# EAGLE design multiplex2 (EAGLE 8.7.1)
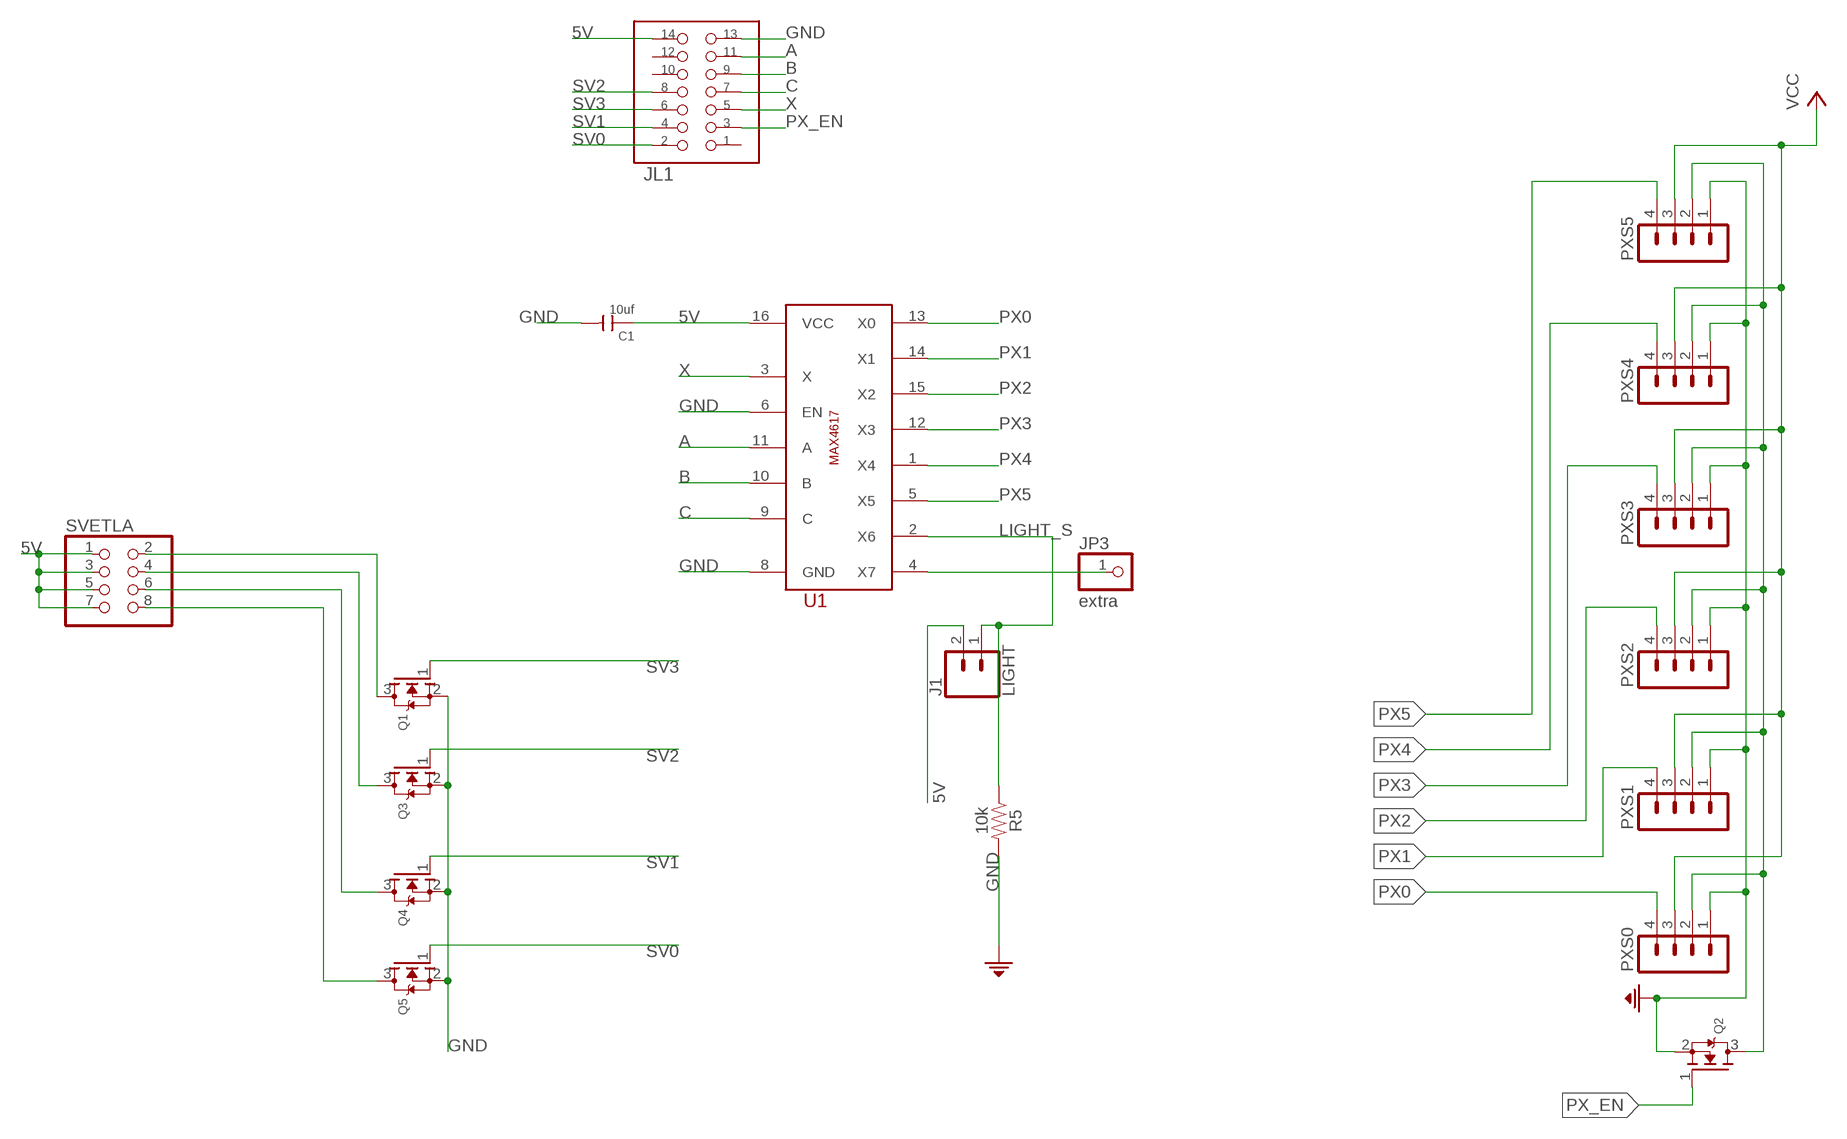
[diagram p0: schematic, sheet 1]

## Parts
C1  10uf  CERAMIC-10UF-25V-10%-X5R(1206)  [C1206]
J1  LIGHT  CONN_02  [1X02]
JL1  DS1014-14S  [DS1014-14S]
JP3  extra  PINHD-1X1  [1X01]
PXS0  MA04-1  [MA04-1]
PXS1  MA04-1  [MA04-1]
PXS2  MA04-1  [MA04-1]
PXS3  MA04-1  [MA04-1]
PXS4  MA04-1  [MA04-1]
PXS5  MA04-1  [MA04-1]
Q1  MOSFET-NREFLOW  [SOT23]
Q2  MOSFET-NREFLOW  [SOT23]
Q3  MOSFET-NREFLOW  [SOT23]
Q4  MOSFET-NREFLOW  [SOT23]
Q5  MOSFET-NREFLOW  [SOT23]
R5  10k  100KOHM-0603-1/10W-1%  [0603]
SVETLA  PINHD-2X4  [2X04]
U1  MAX4617CUE+T  [TSSOP16]

## Nets
5V: C1.1 J1.2 JL1.P$14 PXS0.3 PXS1.3 PXS2.3 PXS3.3 PXS4.3 PXS5.3 SVETLA.1 SVETLA.3 SVETLA.5 SVETLA.7 U1.16(VCC) ; supply symbol labelled VCC
A: JL1.P$11 U1.11(A)
B: JL1.P$9 U1.10(B)
C: JL1.P$7 U1.9(C)
GND: C1.2 JL1.P$13 PXS0.1 PXS1.1 PXS2.1 PXS3.1 PXS4.1 PXS5.1 Q1.2(S) Q2.2(S) Q3.2(S) Q4.2(S) Q5.2(S) R5.2 U1.6(EN) U1.8(GND)
LIGHT_S: J1.1 R5.1 U1.2(X6)
N$1: Q1.3(D) SVETLA.2
N$2: Q3.3(D) SVETLA.4
N$3: Q4.3(D) SVETLA.6
N$4: Q5.3(D) SVETLA.8
N$8: JP3.1 U1.4(X7)
PX0: PXS0.4 U1.13(X0)
PX1: PXS1.4 U1.14(X1)
PX2: PXS2.4 U1.15(X2)
PX3: PXS3.4 U1.12(X3)
PX4: PXS4.4 U1.1(X4)
PX5: PXS5.4 U1.5(X5)
PX_EN: JL1.P$3 Q2.1(G)
PXSO: PXS0.2 PXS1.2 PXS2.2 PXS3.2 PXS4.2 PXS5.2 Q2.3(D)
SV0: JL1.P$2 Q5.1(G)
SV1: JL1.P$4 Q4.1(G)
SV2: JL1.P$8 Q3.1(G)
SV3: JL1.P$6 Q1.1(G)
X: JL1.P$5 U1.3(X)
Unconnected: JL1.P$1 JL1.P$10 JL1.P$12

## Library data of the parts
C1 = OPL_Capacitor:CERAMIC-10UF-25V-10%-X5R(1206): 302010181; MPN: CC1206KKX5R8BB106
J1 = SparkFun-Connectors:CONN_02: Multi connection point. Often used as Generic Header-pin footprint for 0.1 inch spaced/style header connections On any of the 0.1 inch spaced packages, you can populate with these: Break Away Headers - Straight <https://www.sparkfun.com/products/116> (PRT-00116) Break Away Male Headers - Right Angle <https://www.sparkfun.com/products/553> (PRT-00553) Female Headers <https://www.sparkfun.com/products/115> (PRT-00115) Break Away Headers - Machine Pin <https://www.sparkfun.com/products/117> (PRT-00117) Break Away Female Headers - Swiss Machine Pin <https://www.sparkfun.com/products/743> (PRT-00743) For SCREWTERMINALS and SPRING TERMINALS visit here: Screw Terimnals on SparkFun.com <https://www.sparkfun.com/search/results?term=Screw+Terminals> (5mm/3.5mm/2.54mm spacing) This device is also useful as a general connection point to wire up your design to another part of your project. Our various solder wires solder well into these plated through hole pads. Hook-Up Wire - Assortment (Stranded, 22 AWG) <https://www.sparkfun.com/products/11375> (PRT-11375) Hook-Up Wire - Assortment (Solid Core, 22 AWG) <https://www.sparkfun.com/products/11367> (PRT-11367) View the entire wire category on our website here <https://www.sparkfun.com/categories/141> Special notes: Molex polarized connector foot print use with: PRT-08233 with associated crimp pins and housings. 2.54_SCREWTERM for use with PRT-10571. 3.5mm Screw Terminal footprints for PRT-08084 5mm Screw Terminal footprints for use with PRT-08432
JL1 = columba:DS1014-14S
JP3 = adafruit:PINHD-1X1: Pin header 1x1 for 0.1" spacing With round pins
PXS0 PXS1-PXS5 = custom:MA04-1: PIN HEADER; OC_FARNELL: unknown; OC_NEWARK: unknown
Q1-Q5 = adafruit:MOSFET-N: N-Channel Mosfet 2N7002E - 60V 260mA SOT23 [Digikey: 2N7002ET1GOSTR-ND] - REEL BSH103 - 30V 850mA SOT23 [Digikey: 568-5013-1-ND]
R5 = SparkFun-Resistors:100KOHM: 100kΩ resistor A resistor is a passive two-terminal electrical component that implements electrical resistance as a circuit element. Resistors act to reduce current flow, and, at the same time, act to lower voltage levels within circuits. - Wikipedia; PROD_ID: RES-07828; VALUE: 100k
SVETLA = adafruit:PINHD-2X4: PIN HEADER
U1 = columba:MAX4617: 8ch Analog Multiplexer (Switch)

## Board
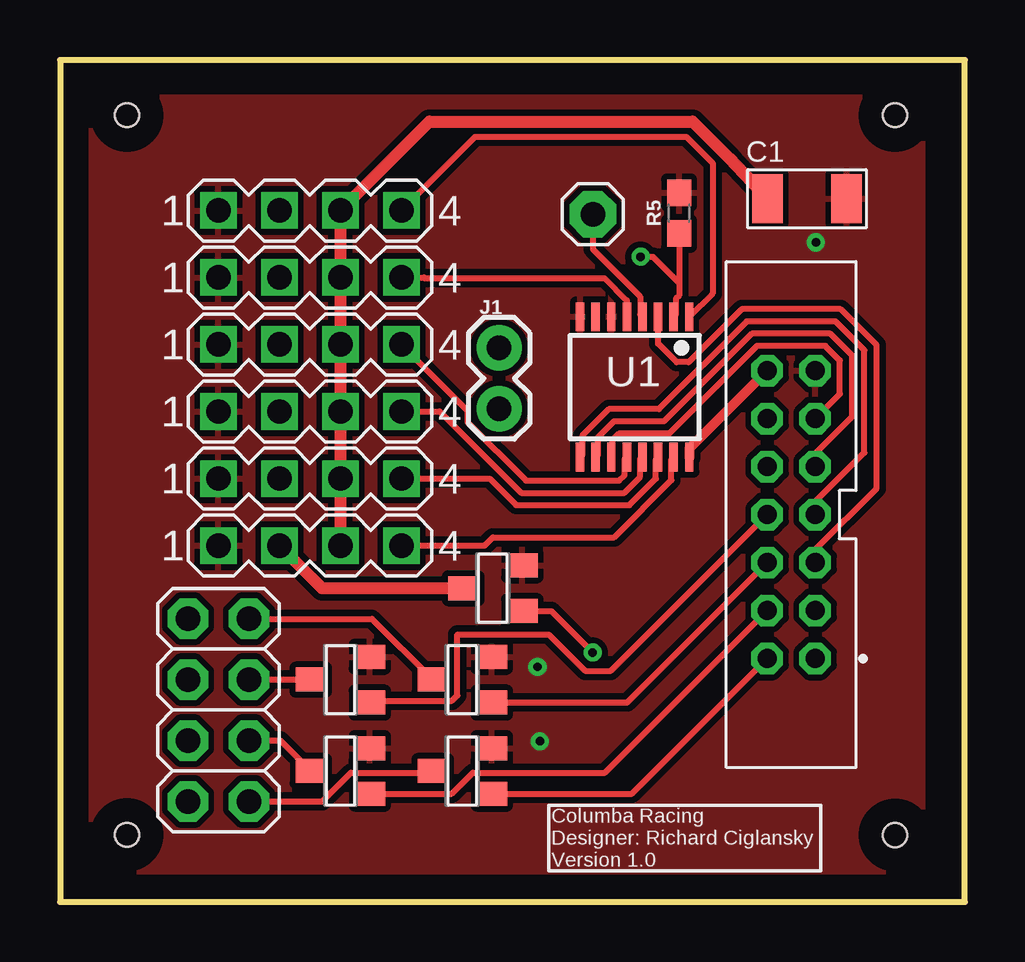
[diagram p1: board, top side]
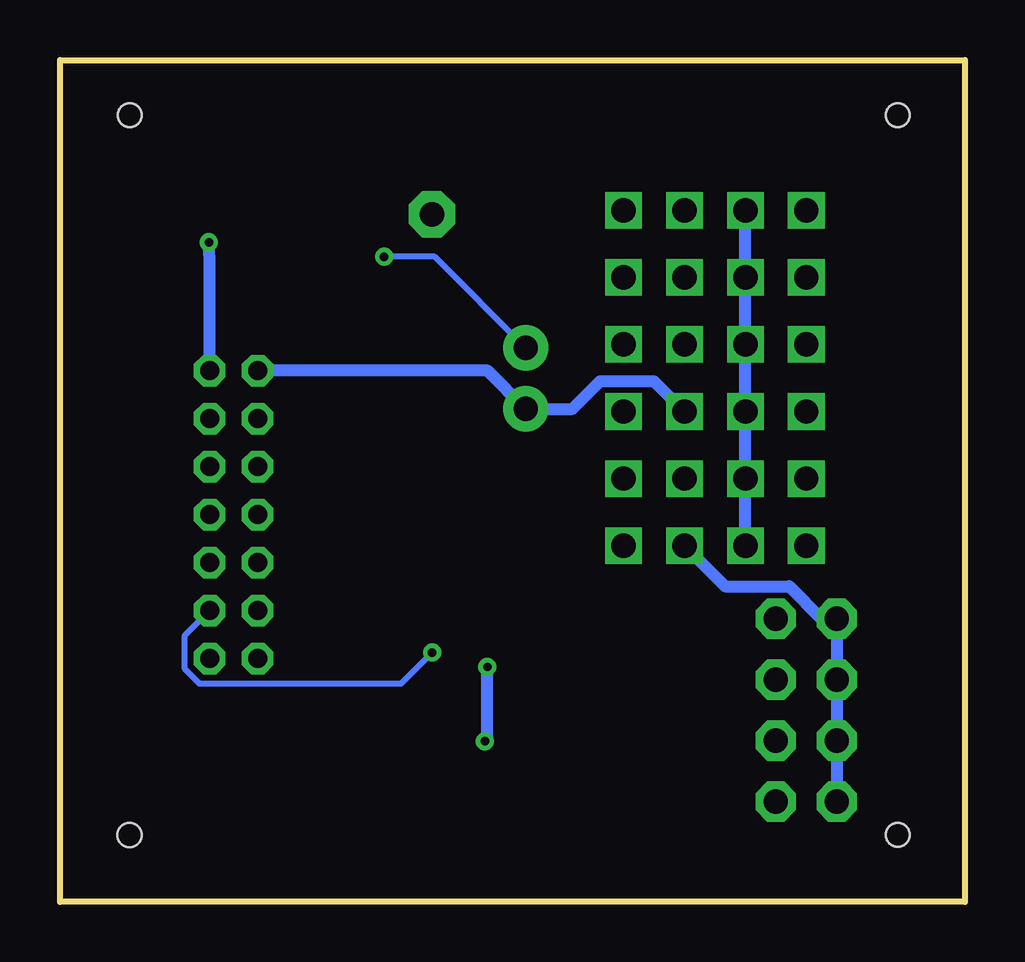
[diagram p2: board, bottom side, seen from below]

Size 37.7 x 35.1 mm. Coordinates in mm from the lower left corner, seen from the top.
Outline: 0,0 37.7,0 37.7,35.1 0,35.1 0,0
Copper layers (1*16): Top 0.035mm / dielectric 1.5mm / Bottom 0.035mm
Design rules "default *": minimum track width 6mil, minimum drill 0.35mm, track to track 10mil, track to pad 10mil, pad to pad 10mil, via to via 10mil, smd to smd 10mil, copper to edge 40mil, drill to drill 6mil, minimum pad ring 10mil, minimum via ring 8mil, stop-mask expansion 4mil, vias tented up to drill 0mil, thermal gap 10mil
Holes 1 mm at 2.79,32.8 34.79,32.8 2.79,2.8 34.8,2.79

### Footprints (pad centres in the part's own frame; a part is rotated, then mirrored left to right if it is on the bottom)
C1206 = smd 1.27 x 2.032: 1 -1.651,0; 2 1.651,0
1X02 = drill 1.016 pad 1.88: 1 0,0; 2 2.54,0
DS1014-14S = drill 0.8 pad 1.27 octagon: P$1 6,1; P$2 6,-1; P$3 4,1; P$4 4,-1; P$5 2,1; P$6 2,-1; P$7 0,1; P$8 0,-1; P$9 -2,1; P$10 -2,-1; P$11 -4,1; P$12 -4,-1; P$13 -6,1; P$14 -6,-1
1X01 = drill 1.016 pad 1.93 octagon: 1 0,0
MA04-1 = drill 1.016 square: 1 -3.81,0; 2 -1.27,0; 3 1.27,0; 4 3.81,0
SOT23 = smd 1 x 1.27: 1 -0.95,-1.227; 2 0.95,-1.227; 3 0,1.227
0603 = smd 1.1 x 1: 1 -0.85,0; 2 0.85,0
2X04 = drill 1.016 pad 1.676 octagon: 1 -3.81,-1.27; 2 -3.81,1.27; 3 -1.27,-1.27; 4 -1.27,1.27; 5 1.27,-1.27; 6 1.27,1.27; 7 3.81,-1.27; 8 3.81,1.27
TSSOP16 = smd 0.35 x 1.2: 1 -2.275,-2.925; 2 -1.625,-2.925; 3 -0.975,-2.925; 4 -0.325,-2.925; 5 0.325,-2.925; 6 0.975,-2.925; 7 1.625,-2.925; 8 2.275,-2.925; 9 2.275,2.925; 10 1.625,2.925; 11 0.975,2.925; 12 0.325,2.925; 13 -0.325,2.925; 14 -0.975,2.925; 15 -1.625,2.925; 16 -2.275,2.925

### Placement (x,y rotation side)
C1  31.12,29.32 0 top
J1  18.29,23.1 270 top
JL1  30.46,16.15 270 top
JP3  22.2,28.67 0 top
PXS0  10.41,20.45 0 top
PXS1  10.41,17.65 0 top
PXS2  10.41,14.86 0 top
PXS3  10.41,23.24 0 top
PXS4  10.41,28.83 0 top
PXS5  10.41,26.03 0 top
Q1  16.76,9.27 90 top
Q2  18.03,13.08 90 top
Q3  11.68,9.27 90 top
Q4  11.68,5.46 90 top
Q5  16.76,5.46 90 top
R5  25.8,28.72 90 top
SVETLA  6.6,8 270 top
U1  23.94,21.47 180 top

### Tracks (layer width: path | path; a pad name or v marks a point on that pad's centre or on a via)
5V
  Top 0.406: JL1.P$14 26.22,18.91 U1.16
  Top 0.508: PXS2.3 PXS1.3 PXS0.3 PXS3.3 PXS5.3 PXS4.3 15.39,32.54 26.36,32.54 27.87,31.02 C1.1
  Bottom 0.508: PXS2.3 9.98,13.16 7.32,13.16 5.97,11.81 SVETLA.1 SVETLA.3 SVETLA.5 SVETLA.7 | PXS0.3 12.95,21.72 15.2,21.72 16.35,20.56 J1.2 19.88,22.15 JL1.P$14
A
  Top 0.254: JL1.P$11 32.5,21.19 32.5,22.58 31.89,23.19 29.04,23.19 25.38,19.53 23.29,19.53 23.02,19.26 23.02,18.59 U1.11
B
  Top 0.254: JL1.P$9 31.46,18.69 33.01,20.23 33.01,22.79 32.1,23.69 28.82,23.69 25.17,20.03 23.08,20.03 22.41,19.37 22.41,18.64 U1.10
C
  Top 0.254: JL1.P$7 31.46,16.69 33.52,18.74 33.52,23 32.31,24.2 28.61,24.2 24.96,20.54 22.87,20.54 21.76,19.44 21.76,18.64 U1.9
GND  (via drill 0.35)
  Bottom 0.508: JL1.P$13 31.46,26.77 v31.49,27.5 | v19.99,6.7 19.89,6.8 v19.89,9.8
  pour Top: 0.89,33.4 0.89,1.27 1.02,1.14 35.18,1.14 35.94,1.91 35.94,33.53 1.02,33.53
LIGHT_S  (via drill 0.35)
  Top 0.254: R5.1 25.8,25.8 | 25.8,25.8 25.8,25.29 25.66,25.15 25.66,24.49 U1.2 | v24.19,26.9 24.7,26.9 25.8,25.8
  Bottom 0.254: J1.1 22.09,26.9 v24.19,26.9
N$1
  Top 0.254: SVETLA.2 13,11.81 Q1.3
N$2
  Top 0.254: SVETLA.4 Q3.3
N$3
  Top 0.254: SVETLA.6 9.19,6.73 Q4.3
N$4
  Top 0.254: SVETLA.8 10.92,4.19 12.12,5.39 15.47,5.39 Q5.3
N$8
  Top 0.254: U1.4 24.18,24.49 24.18,25.24 22.2,27.21 JP3.1
PX0
  Top 0.254: U1.13 24.18,18.45 24.18,17.72 23.51,17.06 19.21,17.06 15.82,20.45 PXS0.4
PX1
  Top 0.254: PXS1.4 17.9,17.65 19,16.55 23.72,16.55 24.82,17.65 24.82,18.45 U1.14
PX2
  Top 0.254: U1.15 25.48,18.45 25.48,17.58 23.09,15.2 18.04,15.2 17.7,14.86 PXS2.4
PX3
  Top 0.254: PXS3.4 16.97,20.49 16.97,20.01 19.42,17.56 23.3,17.56 23.53,17.79 23.53,18.45 U1.12
PX4
  Top 0.254: PXS4.4 17.3,31.9 26.09,31.9 27.19,30.8 27.19,25.37 U1.1
PX5
  Top 0.254: PXS5.4 15.16,26.03 15.19,26 22.69,26 23.62,25.08 U1.5
PX_EN  (via drill 0.35)
  Top 0.254: Q2.1 20.46,12.13 v22.19,10.4
  Bottom 0.254: v22.19,10.4 23.49,9.1 31.88,9.1 32.5,9.72 32.5,11.12 JL1.P$3
PXSO
  Top 0.508: Q2.3 13.79,13.08 11.19,13.08 10.92,13.08 PXS2.2
  Bottom 0.508: PXS2.2 PXS1.2 PXS0.2 PXS3.2 PXS5.2 PXS4.2
SV0
  Top 0.254: Q5.1 23.82,4.51 JL1.P$2
SV1
  Top 0.254: Q4.1 16.32,4.51 17.2,5.39 22.71,5.39 JL1.P$4
SV2
  Top 0.254: Q3.1 12.98,8.39 16.33,8.39 16.55,8.61 16.55,11.15 20.37,11.15 21.88,9.64 22.96,9.64 JL1.P$8
SV3
  Top 0.254: Q1.1 23.63,8.32 JL1.P$6
X
  Top 0.254: JL1.P$5 31.46,14.69 34.02,17.25 34.02,23.21 32.52,24.71 28.4,24.71 26.2,22.5 25.69,22.5 24.92,23.28 U1.3

### Text on the board
tNames: Columba Racing / Designer: Richard Ciglansky / Version 1.0